# EAGLE schematic NSE2024_MORIMORI (EAGLE 9.6.2)
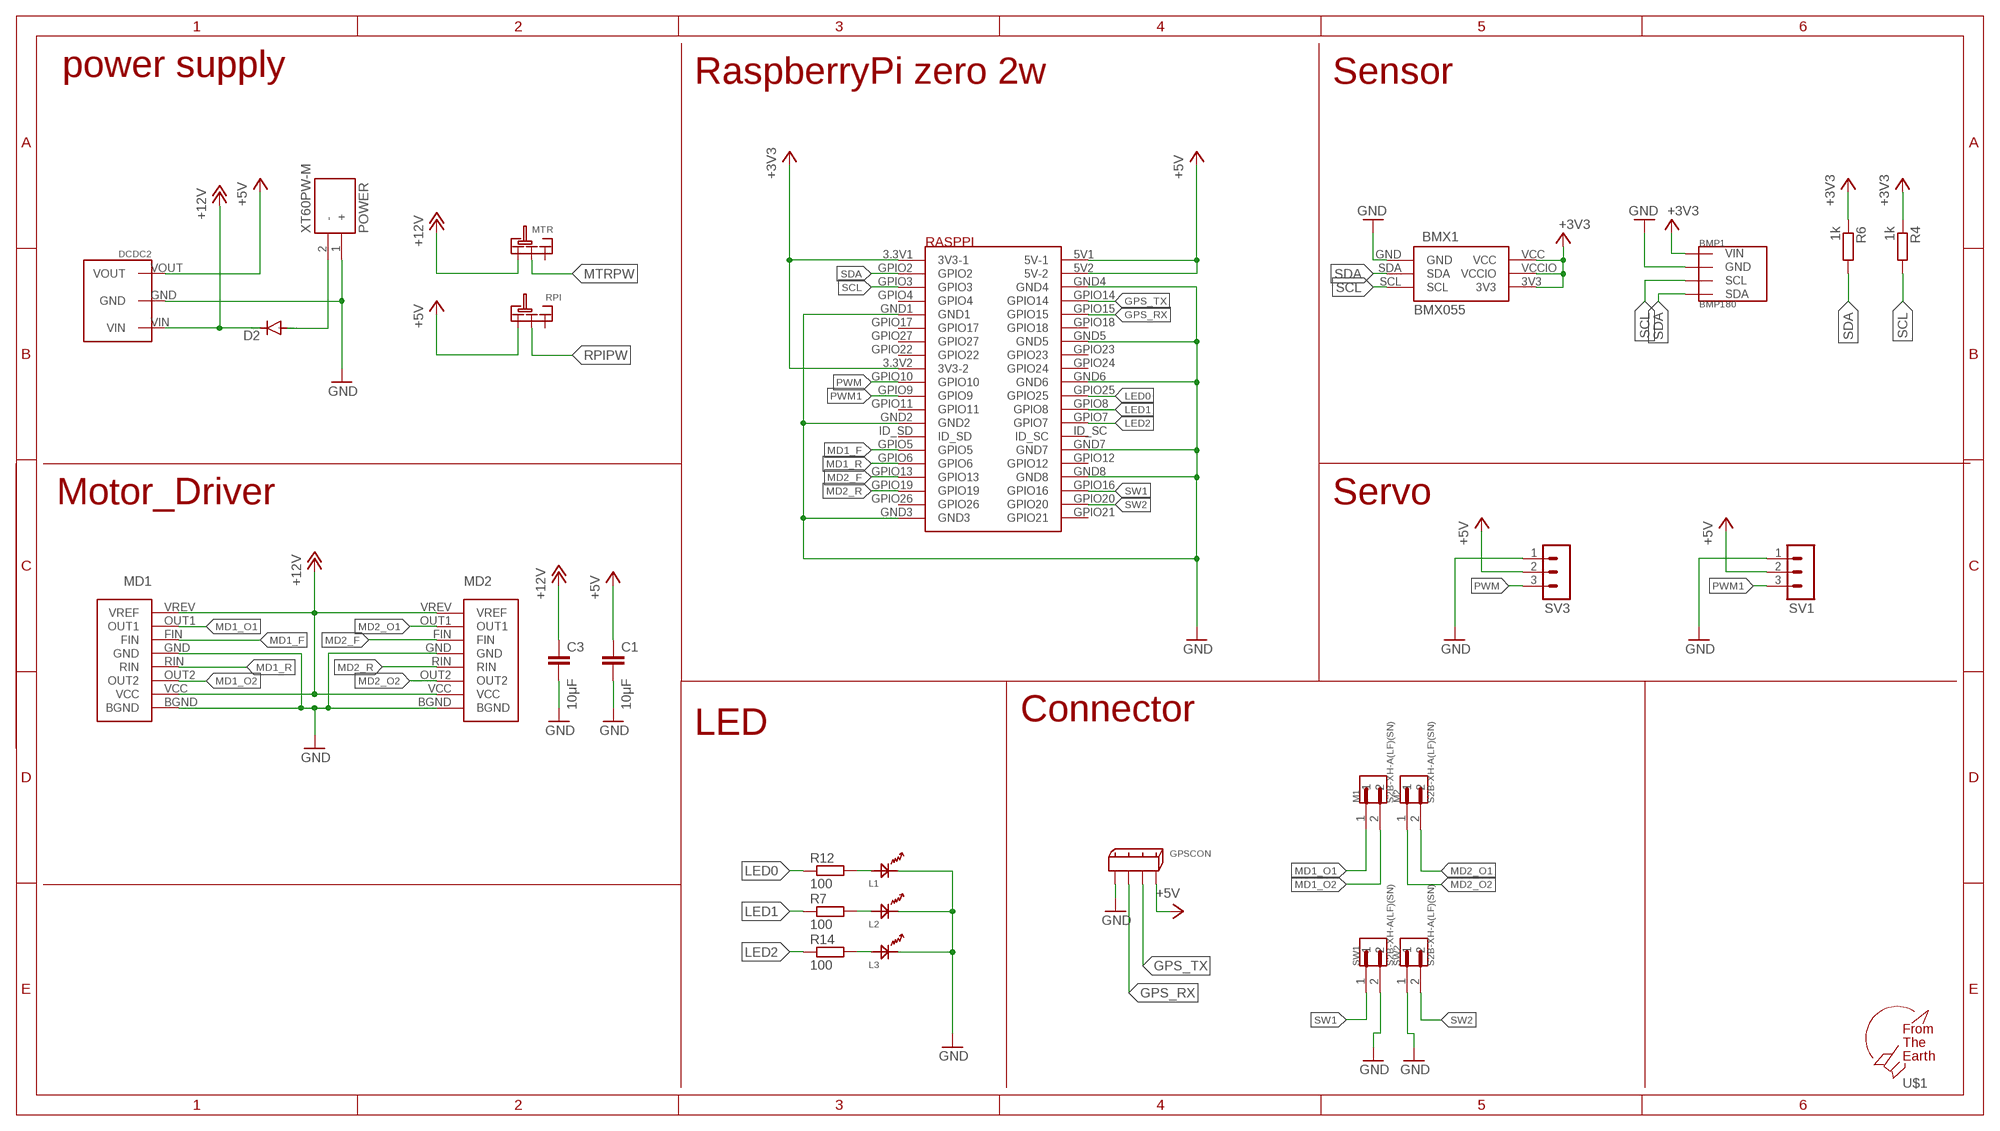
[diagram p0: schematic, sheet 1]

## Parts
BMP1  BMP180  [GY-68]
BMX1  BMX055  [BMX055]
C1  10μF  C-EUC0603  [C0603]
C3  10μF  C-EUC0603  [C0603]
D2  1N4148DO35-7  [DO35-7]
DCDC2  3.3V1A_M78AR033-1  [3.3V1A_M78AR033-1]
GPSCON  2.5_MINI-SPOX_4PIN  [2.5_MINI-SPOX_4PIN]
L1  OSXX1608C1A  [OSXX1608C1A]
L2  OSXX1608C1A  [OSXX1608C1A]
L3  OSXX1608C1A  [OSXX1608C1A]
M1  S2B-XH-A(LF)(SN)  [JST_S2B-XH-A(LF)(SN)]
M2  S2B-XH-A(LF)(SN)  [JST_S2B-XH-A(LF)(SN)]
MD1  BD6222HFP-TR  [BD6222HFP-TR]
MD2  BD6222HFP-TR  [BD6222HFP-TR]
MTR  SRIDE_SWITCH  [SRIDE_SWITCH]
POWER  XT60PW-M  [AMASS_XT60PW-M]
R4  1k  R-EU_R0603  [R0603]
R6  1k  R-EU_R0603  [R0603]
R7  100  R-EU_R0603  [R0603]
R12  100  R-EU_R0603  [R0603]
R14  100  R-EU_R0603  [R0603]
RASPPI  RASPBERYPIZEROW  [RASPBERYPIZEROW]
RPI  SRIDE_SWITCH  [SRIDE_SWITCH]
SV1  MA03-1  [MA03-1]
SV3  MA03-1  [MA03-1]
SW1  S2B-XH-A(LF)(SN)  [JST_S2B-XH-A(LF)(SN)]
SW2  S2B-XH-A(LF)(SN)  [JST_S2B-XH-A(LF)(SN)]
U$1  F.T.E.LOGO  [LOGO]

## Nets
+3V3: BMP1.P1(VIN) BMX1.3V3 BMX1.VCC BMX1.VCCIO R4.1 R6.1 RASPPI.3.3V1(3V3-1) RASPPI.3.3V2(3V3-2)
+5V: C1.1 DCDC2.VOUT GPSCON.P$4 RASPPI.5V1(5V-1) RASPPI.5V2(5V-2) RPI.L SV1.2 SV3.2
+12V: C3.1 D2.C DCDC2.VIN MD1.VCC MD1.VREV(VREF) MD2.VCC MD2.VREV(VREF) MTR.L
GND: BMP1.P2(GND) BMX1.GND C1.2 C3.2 DCDC2.GND GPSCON.P$1 L1.CT L2.CT L3.CT MD1.BGND MD1.GND MD2.BGND MD2.GND POWER.1(+) RASPPI.GND1 RASPPI.GND2 RASPPI.GND3 RASPPI.GND4 RASPPI.GND5 RASPPI.GND6 RASPPI.GND7 RASPPI.GND8 SV1.1 SV3.1 SW1.2 SW2.1
GPS_RX: GPSCON.P$2 RASPPI.GPIO15
GPS_TX: GPSCON.P$3 RASPPI.GPIO14
LED0: R12.1 RASPPI.GPIO25
LED1: R7.1 RASPPI.GPIO8
LED2: R14.1 RASPPI.GPIO7
MD1_F: MD1.FIN RASPPI.GPIO5
MD1_O1: M1.1 MD1.OUT1
MD1_O2: M1.2 MD1.OUT2
MD1_R: MD1.RIN RASPPI.GPIO6
MD2_F: MD2.FIN RASPPI.GPIO13
MD2_O1: M2.2 MD2.OUT1
MD2_O2: M2.1 MD2.OUT2
MD2_R: MD2.RIN RASPPI.GPIO19
MTRPW: MTR.LR
N$1: D2.A POWER.2(-)
N$2: L1.AN R12.2
N$3: L2.AN R7.2
N$4: L3.AN R14.2
PWM: RASPPI.GPIO10 SV3.3
PWM1: RASPPI.GPIO9 SV1.3
RPIPW: RPI.LR
SCL: BMP1.P3(SCL) BMX1.SCL R4.2 RASPPI.GPIO3
SDA: BMP1.P4(SDA) BMX1.SDA R6.2 RASPPI.GPIO2
SW1: RASPPI.GPIO16 SW1.1
SW2: RASPPI.GPIO20 SW2.2
Unconnected: MTR.R RASPPI.GPIO4 RASPPI.GPIO11 RASPPI.GPIO12 RASPPI.GPIO17 RASPPI.GPIO18 RASPPI.GPIO21 RASPPI.GPIO22 RASPPI.GPIO23 RASPPI.GPIO24 RASPPI.GPIO26 RASPPI.GPIO27 RASPPI.ID_SC RASPPI.ID_SD RPI.R

## Notes on the sheet
- power supply | RaspberryPi zero 2w | Sensor
- Motor_Driver | Servo
- Connector
- LED

## Library data of the parts
BMP1 = BMP180:BMP180
BMX1 = BMX055:BMX055
C1 C3 = rcl:C-EU: CAPACITOR, European symbol; SPICEPREFIX: C
D2 = diode:1N4148: DIODE high speed (Philips)
DCDC2 = DC-DC:3.3V1A_M78AR033-1
GPSCON = Connector:2.5_MINI-SPOX_4PIN
L1-L3 = Chip LED:OSXX1608C1A
M1 M2 SW1 SW2 = S2B-XH-A_LF__SN_:S2B-XH-A(LF)(SN): XH Series 2.5mm 2 Position Through Hole Shrouded Header Connector Check availability <https://pricing.snapeda.com/parts/S2B-XH-A%28LF%29%28SN%29/JST%20Sales%20America%20Inc./view-part?ref=eda>; AVAILABILITY: In Stock; CHECK_PRICES: https://www.snapeda.com/parts/S2B-XH-A(LF)(SN)/JST+Sales+America+Inc./view-part/?ref=eda; DESCRIPTION: Connector Header Through Hole, Right Angle 2 position 0.098 (2.50mm); MF: JST Sales America Inc.; MP: S2B-XH-A(LF)(SN); PACKAGE: None; PRICE: None; SNAPEDA_LINK: https://www.snapeda.com/parts/S2B-XH-A(LF)(SN)/JST+Sales+America+Inc./view-part/?ref=snap
MD1 MD2 = BD6222HFP-TR:BD6222HFP-TR
MTR RPI = Sride Switch:SRIDE_SWITCH
POWER = XT60PW-M:XT60PW-M: Check availability <https://pricing.snapeda.com/parts/XT60PW-M/AMASS/view-part?ref=eda>; AVAILABILITY: Not in stock; CHECK_PRICES: https://www.snapeda.com/parts/XT60PW-M/AMASS/view-part/?ref=eda; DESCRIPTION: Socket, DC supply, male, PIN: 2; MF: AMASS; MP: XT60PW-M; PACKAGE: Package; PRICE: None; SNAPEDA_LINK: https://www.snapeda.com/parts/XT60PW-M/AMASS/view-part/?ref=snap
R4 R6 R7 R12 R14 = rcl:R-EU_: RESISTOR, European symbol; SPICEPREFIX: R
RASPPI = RaspberyPiZeroW:RASPBERYPIZEROW
SV1 SV3 = con-lstb:MA03-1: PIN HEADER; OC_FARNELL: unknown; OC_NEWARK: unknown
U$1 = logo:F.T.E.LOGO

## Net classes
1 power: width 0.762 mm